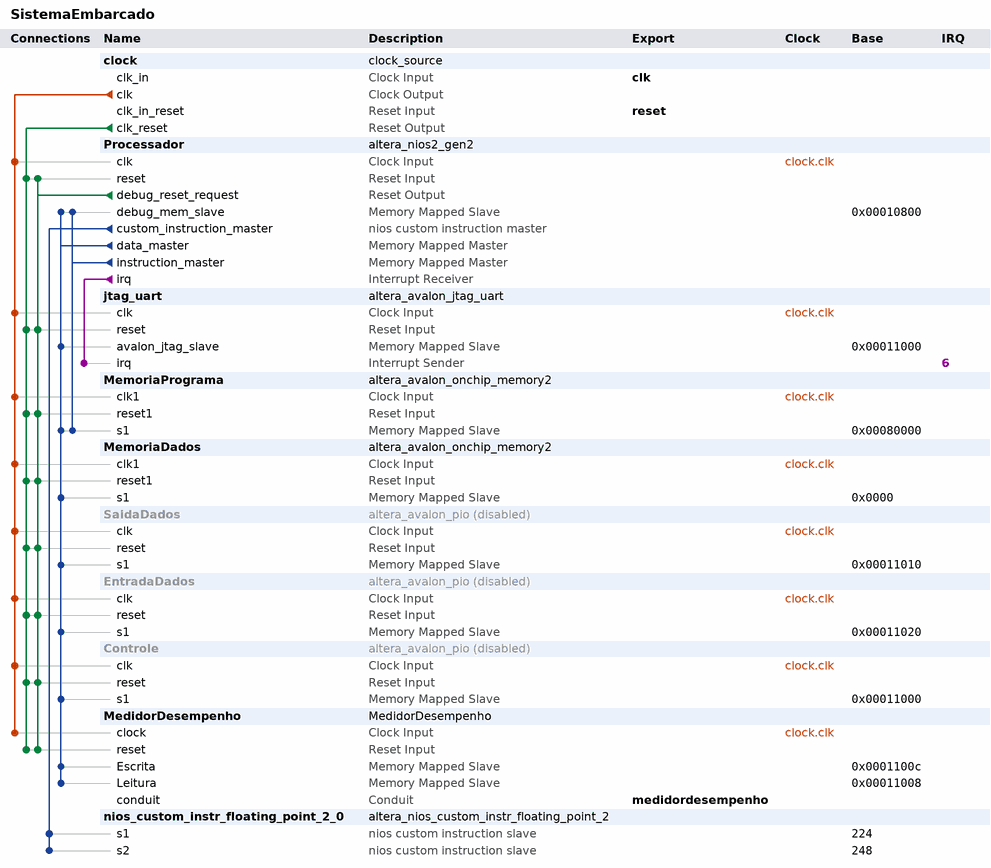
[diagram p0: system contents]
# Platform Designer (Qsys) system SistemaEmbarcado, Cyclone IV E EP4CE115F29C7
# Parameters at their usual value, and those the tool derives, are not listed.
package require -exact qsys 18.1
create_system SistemaEmbarcado
set_project_property DEVICE_FAMILY {Cyclone IV E}
set_project_property DEVICE EP4CE115F29C7

add_instance clock clock_source 18.1
set_instance_parameter_value clock clockFrequency 50000000

add_instance Processador altera_nios2_gen2 18.1
set_instance_parameter_value Processador dcache_size 2048
set_instance_parameter_value Processador exceptionSlave MemoriaPrograma.s1
set_instance_parameter_value Processador icache_size 4096
set_instance_parameter_value Processador impl Tiny
set_instance_parameter_value Processador resetSlave MemoriaPrograma.s1

add_instance jtag_uart altera_avalon_jtag_uart 18.1
set_instance_parameter_value jtag_uart simInteractiveOptions NO_INTERACTIVE_WINDOWS

add_instance MemoriaPrograma altera_avalon_onchip_memory2 18.1
set_instance_parameter_value MemoriaPrograma dataWidth 32
set_instance_parameter_value MemoriaPrograma dualPort false
set_instance_parameter_value MemoriaPrograma initMemContent true
set_instance_parameter_value MemoriaPrograma initializationFileName onchip_mem.hex
set_instance_parameter_value MemoriaPrograma memorySize 204800

add_instance MemoriaDados altera_avalon_onchip_memory2 18.1
set_instance_parameter_value MemoriaDados dataWidth 32
set_instance_parameter_value MemoriaDados dualPort false
set_instance_parameter_value MemoriaDados initMemContent true
set_instance_parameter_value MemoriaDados initializationFileName onchip_mem.hex
set_instance_parameter_value MemoriaDados memorySize 65536

add_instance SaidaDados altera_avalon_pio 18.1
set_instance_property SaidaDados ENABLED false
set_instance_parameter_value SaidaDados direction Output
set_instance_parameter_value SaidaDados width 32

add_instance EntradaDados altera_avalon_pio 18.1
set_instance_property EntradaDados ENABLED false
set_instance_parameter_value EntradaDados direction Input
set_instance_parameter_value EntradaDados width 32

add_instance Controle altera_avalon_pio 18.1
set_instance_property Controle ENABLED false
set_instance_parameter_value Controle direction Input
set_instance_parameter_value Controle width 32

add_instance MedidorDesempenho MedidorDesempenho 1.0

add_instance nios_custom_instr_floating_point_2_0 altera_nios_custom_instr_floating_point_2 18.1
set_instance_parameter_value nios_custom_instr_floating_point_2_0 arithmetic_present true
set_instance_parameter_value nios_custom_instr_floating_point_2_0 comparison_present true
set_instance_parameter_value nios_custom_instr_floating_point_2_0 conversion_present true
set_instance_parameter_value nios_custom_instr_floating_point_2_0 root_present false

# connections
add_connection clock.clk Controle.clk clock
add_connection clock.clk EntradaDados.clk clock
add_connection clock.clk jtag_uart.clk clock
add_connection clock.clk MedidorDesempenho.clock clock
add_connection clock.clk MemoriaDados.clk1 clock
add_connection clock.clk MemoriaPrograma.clk1 clock
add_connection clock.clk Processador.clk clock
add_connection clock.clk SaidaDados.clk clock
add_connection clock.clk_reset Controle.reset reset
add_connection clock.clk_reset EntradaDados.reset reset
add_connection clock.clk_reset jtag_uart.reset reset
add_connection clock.clk_reset MedidorDesempenho.reset reset
add_connection clock.clk_reset MemoriaDados.reset1 reset
add_connection clock.clk_reset MemoriaPrograma.reset1 reset
add_connection clock.clk_reset Processador.reset reset
add_connection clock.clk_reset SaidaDados.reset reset
add_connection Processador.debug_reset_request Controle.reset reset
add_connection Processador.debug_reset_request EntradaDados.reset reset
add_connection Processador.debug_reset_request jtag_uart.reset reset
add_connection Processador.debug_reset_request MedidorDesempenho.reset reset
add_connection Processador.debug_reset_request MemoriaDados.reset1 reset
add_connection Processador.debug_reset_request MemoriaPrograma.reset1 reset
add_connection Processador.debug_reset_request Processador.reset reset
add_connection Processador.debug_reset_request SaidaDados.reset reset
add_connection Processador.data_master Controle.s1 avalon
set_connection_parameter_value Processador.data_master/Controle.s1 baseAddress 0x00011000
add_connection Processador.data_master EntradaDados.s1 avalon
set_connection_parameter_value Processador.data_master/EntradaDados.s1 baseAddress 0x00011020
add_connection Processador.data_master jtag_uart.avalon_jtag_slave avalon
set_connection_parameter_value Processador.data_master/jtag_uart.avalon_jtag_slave baseAddress 0x00011000
add_connection Processador.data_master MedidorDesempenho.Escrita avalon
set_connection_parameter_value Processador.data_master/MedidorDesempenho.Escrita baseAddress 0x0001100c
add_connection Processador.data_master MedidorDesempenho.Leitura avalon
set_connection_parameter_value Processador.data_master/MedidorDesempenho.Leitura baseAddress 0x00011008
add_connection Processador.data_master MemoriaDados.s1 avalon
set_connection_parameter_value Processador.data_master/MemoriaDados.s1 baseAddress 0x0000
add_connection Processador.data_master MemoriaPrograma.s1 avalon
set_connection_parameter_value Processador.data_master/MemoriaPrograma.s1 baseAddress 0x00080000
add_connection Processador.data_master Processador.debug_mem_slave avalon
set_connection_parameter_value Processador.data_master/Processador.debug_mem_slave baseAddress 0x00010800
add_connection Processador.data_master SaidaDados.s1 avalon
set_connection_parameter_value Processador.data_master/SaidaDados.s1 baseAddress 0x00011010
add_connection Processador.instruction_master MemoriaPrograma.s1 avalon
set_connection_parameter_value Processador.instruction_master/MemoriaPrograma.s1 baseAddress 0x00080000
add_connection Processador.instruction_master Processador.debug_mem_slave avalon
set_connection_parameter_value Processador.instruction_master/Processador.debug_mem_slave baseAddress 0x00010800
add_connection Processador.irq jtag_uart.irq interrupt
set_connection_parameter_value Processador.irq/jtag_uart.irq irqNumber 6
add_connection Processador.custom_instruction_master nios_custom_instr_floating_point_2_0.s1 nios_custom_instruction
set_connection_parameter_value Processador.custom_instruction_master/nios_custom_instr_floating_point_2_0.s1 CIName nios_custom_instr_floating_point_2_0
set_connection_parameter_value Processador.custom_instruction_master/nios_custom_instr_floating_point_2_0.s1 baseAddress 224
add_connection Processador.custom_instruction_master nios_custom_instr_floating_point_2_0.s2 nios_custom_instruction
set_connection_parameter_value Processador.custom_instruction_master/nios_custom_instr_floating_point_2_0.s2 CIName nios_custom_instr_floating_point_2_0_1
set_connection_parameter_value Processador.custom_instruction_master/nios_custom_instr_floating_point_2_0.s2 baseAddress 248

# exported interfaces
add_interface clk clock sink
set_interface_property clk EXPORT_OF clock.clk_in
add_interface medidordesempenho conduit end
set_interface_property medidordesempenho EXPORT_OF MedidorDesempenho.conduit
add_interface reset reset sink
set_interface_property reset EXPORT_OF clock.clk_in_reset

set_interconnect_requirement {$system} qsys_mm.clockCrossingAdapter HANDSHAKE
set_interconnect_requirement {$system} qsys_mm.enableEccProtection FALSE
set_interconnect_requirement {$system} qsys_mm.insertDefaultSlave FALSE
set_interconnect_requirement {$system} qsys_mm.maxAdditionalLatency 1

save_system SistemaEmbarcado.qsys
